# Altium schematic sheet p2_standby.SchDoc
size A2; Organization: Protel International P/L; Address1: L3, 12a Rodborough Rd; Address2: Frenchs Forest; Address3: NSW; Address4: Australia 2086
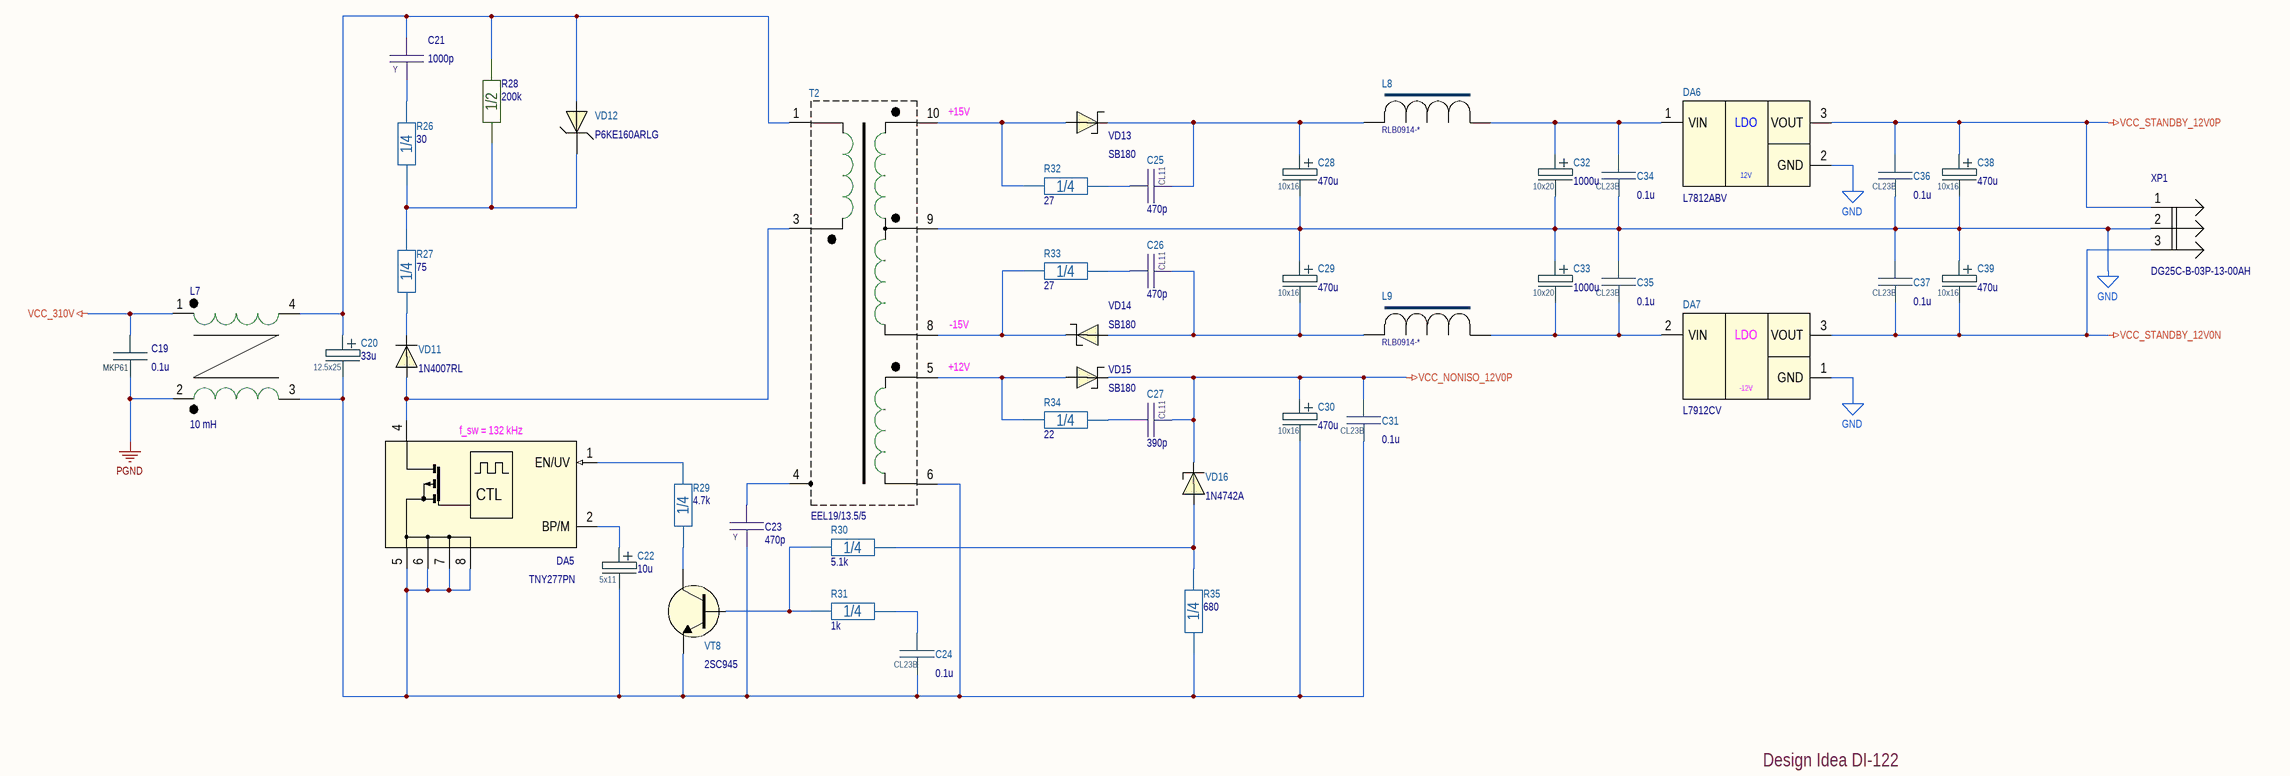
[diagram p0: p2_standby.SchDoc]

## Parts
C19  0.1u  [MKP61_13x12x6_P10]
C20  33u  Package: 12.5x25  [ECAP13X21X5_BRW]
C21  1000p  Package: Y  [JYC_Y2_CAP_7.5]
C22  10u  Package: 5x11  [ECAP5X11X2.0_BRW]
C23  470p  Package: Y  [JYC_Y2_CAP_6.5]
C24  0.1u  [CL23B_7.2x2.5]
C25  470p  [CL11_6x4_P4.0]
C26  470p  [CL11_6x4_P4.0]
C27  390p  [CL11_6x4_P4.0]
C28  470u  Package: 10x16  [ECAP10X17X5_BRW]
C29  470u  Package: 10x16  [ECAP10X17X5_BRW]
C30  470u  Package: 10x16  [ECAP10X17X5_BRW]
C31  0.1u  [CL23B_7.2x2.5]
C32  1000u  Package: 10x20  [ECAP10X21X5_BRW]
C33  1000u  Package: 10x20  [ECAP10X21X5_BRW]
C34  0.1u  [CL23B_7.2x2.5]
C35  0.1u  [CL23B_7.2x2.5]
C36  0.1u  [CL23B_7.2x2.5]
C37  0.1u  [CL23B_7.2x2.5]
C38  470u  Package: 10x16  [ECAP10X17X5_BRW]
C39  470u  Package: 10x16  [ECAP10X17X5_BRW]
DA5  TNY277PN  [DIP-8C]
DA6  L7812ABV  [TO-220AB-3]
DA7  L7912CV  [TO-220AB-3]
L7  10 mH  [UU9.8]
L8  RLB0914-*  [RLB0914]
L9  RLB0914-*  [RLB0914]
R26  30  Package: 1/4  [CFR-25]
R27  75  Package: 1/4  [CFR-25]
R28  200k  Package: 1/2  [CFR-50]
R29  4.7k  Package: 1/4  [CFR-25]
R30  5.1k  Package: 1/4  [CFR-25]
R31  1k  Package: 1/4  [CFR-25]
R32  27  Package: 1/4  [CFR-25]
R33  27  Package: 1/4  [CFR-25]
R34  22  Package: 1/4  [CFR-25]
R35  680  Package: 1/4  [CFR-25]
T2  EEL19/13.5/5  [EEL19/13.5/5]
VD11  1N4007RL  [DO-41]
VD12  P6KE160ARLG  [DO-15]
VD13  SB180  [DO-41]
VD14  SB180  [DO-41]
VD15  SB180  [DO-41]
VD16  1N4742A  [DO-41 GLASS DARK RED]
VT8  2SC945  [TO-92 (VERTICAL,LINE)]
XP1  DG25C-B-03P-13-00AH  [DG25C-B-03P-13-00AH]

## Nets
GND: C28.2 C29.1 C32.2 C33.1 C34.2 C35.1 C36.2 C37.1 C38.2 C39.1 DA6.2(GND) DA7.1(GND) T2.9 XP1.2
PGND: C19.1 L7.2
VCC_310V: C19.2 L7.1
VCC_NONISO_12V0P: C27.1 C30.1 C31.1 VD15.1(C) VD16.1(CATHODE)
VCC_STANDBY_12V0N: C37.2 C39.2 DA7.3(VOUT) XP1.3
VCC_STANDBY_12V0P: C36.1 C38.1 DA6.3(VOUT) XP1.1
NetC20_1: C20.1 C21.2 L7.4 R28.2 T2.1 VD12.2(A)
NetC20_2: C20.2 C22.2 C23.2 C24.2 C30.2 C31.2 DA5.5(SOURCE) DA5.6(SOURCE) DA5.7(SOURCE) DA5.8(SOURCE) L7.3 R35.2 T2.6 VT8.3(E)
NetC21_1: C21.1 R26.1
NetC22_1: C22.1 DA5.2(BP/M)
NetC23_1: C23.1 T2.4
NetC24_1: C24.1 R31.2
NetC25_1: C25.1 C28.1 L8.1 VD13.1(C)
NetC25_2: C25.2 R32.1
NetC26_1: C26.1 C29.2 L9.1 VD14.2(A)
NetC26_2: C26.2 R33.1
NetC27_2: C27.2 R34.1
NetC32_1: C32.1 C34.1 DA6.1(VIN) L8.2
NetC33_2: C33.2 C35.2 DA7.2(VIN) L9.2
NetDA5_1: DA5.1(EN/UV) R29.1
NetDA5_4: DA5.4(DRAIN) T2.3 VD11.2(A)
NetR26_2: R26.2 R27.1 R28.1 VD12.1(C)
NetR27_2: R27.2 VD11.1(C)
NetR29_2: R29.2 VT8.2(C)
NetR30_1: R30.1 R35.1 VD16.2(ANODE)
NetR30_2: R30.2 R31.1 VT8.1(B)
NetR32_2: R32.2 T2.10 VD13.2(A)
NetR33_2: R33.2 T2.8 VD14.1(C)
NetR34_2: R34.2 T2.5 VD15.2(A)

## Notes on the sheet
- (near T2) +15V
- (near T2) -15V
- (near T2) +12V
- (near DA5) f_sw = 132 kHz
- Design Idea DI-122 <https://www.power.com/sites/default/files/documents/di122.pdf>
- Title
- Size:
- Date:
- File:
- A2
- Number:
- Time:
- Revision:
- Sheet
- of
- (in symbol L7812ABV) LDO; 12V
- (in symbol L7912CV) LDO; -12V
- (in symbol TNY277PN) CTL

## Library data of the parts
C19 = MKP61: Metallized Polypropylene Film Capacitor for high voltage application; Tolerance: ± 10 %; Voltage: 300V; Value: 0.1u; Dielectric: Polypropylene; Value on schem: 0.1u; Part Number: *; Manufacturer: *; Package: MKP61
C20 = C_ECAP: Aluminium capacitor; Part Number: UCY2G330MHD; Manufacturer: Nichicon; Tolerance: ± 20 %; Voltage: 400V; Value: 33u; Value on schem: 33u
C21 = JB_Y2: High Voltage Ceramic Capacitor; Part Number: JYC3D102MBE; Manufacturer: JB; Tolerance: ± 20 %; Dielectric: Y5U; Voltage: 2000V; Value: 1000p; Value on schem: 1000p
C22 = C_ECAP: Aluminium capacitor; Part Number: UVR1J100MDD1TA; Manufacturer: Nichicon; Tolerance: ± 20 %; Voltage: 63V; Value: 10u; Value on schem: 10u
C23 = JB_Y2: High Voltage Ceramic Capacitor; Part Number: JYC3D471KBB; Manufacturer: JB; Tolerance: ± 10 %; Dielectric: Y5P; Voltage: 2000V; Value: 470p; Value on schem: 470p
C24 C31 C34-C37 = CL23B: Box-type metallized polyester film capacitor; Tolerance: ± * %; Voltage: 63V; Value: 0.1u; Dielectric: Polyester; Value on schem: 0.1u; Part Number: *; Manufacturer: *; Package: CL23B
C25 C26 = CL11: CL11 Type Polyester Film Metal Foil Capacitor-inductive; Part Number: CL11-2A471J; Manufacturer: Shengxin Capacitors; Tolerance: ± 5 %; Voltage: 100V; Value: 470p; Dielectric: Polyester; Value on schem: 470p; Package: CL11
C27 = CL11: CL11 Type Polyester Film Metal Foil Capacitor-inductive; Part Number: CL11-2A391J; Manufacturer: Shengxin Capacitors; Tolerance: ± 5 %; Voltage: 100V; Value: 390p; Dielectric: Polyester; Value on schem: 390p; Package: CL11
C28-C30 C38 C39 = C_ECAP: Aluminium capacitor; Part Number: UPW1E471MPD; Manufacturer: Nichicon; Tolerance: ± 20 %; Voltage: 25V; Value: 470u; Value on schem: 470u
C32 C33 = C_ECAP: Aluminium capacitor; Part Number: UVZ1E102MPD; Manufacturer: Nichicon; Tolerance: ± 20 %; Voltage: 25V; Value: 1000u; Value on schem: 1000u
DA5 = TNY277PN: Energy-Effi cient, Off-Line Switcher With Enhanced Flexibility and Extended Power Range; Manufacturer: Power Integrations; Package: DIP-8C; Part Number: TNY277PN
DA6 = L7812ABV: 12V, 1,5 A voltage regulator (Fixed version); Manufacturer: STMicroelectronics; Package: TO-220; Part Number: L7812ABV
DA7 = L7912CV: -12V, 1,5 A voltage regulator (Fixed version); Manufacturer: STMicroelectronics; Package: TO-220; Part Number: L7912CV
L7 = UU9.8: UU9.8 Ferrite Core inductor; Value: 10 mH; Core: UU9.8
L8 L9 = RLB0914: Radial Inductors; Manufacturer: Bourns Inc.; RDC: * Ohm; SRF Min: * MHz; Irms  Max: * A; Inductance @ 100 kHz: * µH; Part Number: RLB0914-*; Package: 8.7x12mm; Q: *; Isat  Typ: * A
R26 = CF25: Resistor 1/4W; Part Number: MFR-25FTF52-30R; Manufacturer: Yageo; Tolerance: ± 1 %; Voltage: 250V; Temperature Coefficient: ±100 ppm/°C; Value: 30; Value on schem: 30
R27 = CF25: Resistor 1/4W; Part Number: MFR-25FTF52-75R; Manufacturer: Yageo; Tolerance: ± 1 %; Voltage: 250V; Temperature Coefficient: ±100 ppm/°C; Value: 75; Value on schem: 75
R28 = CF50: Resistor 1/2W; Part Number: MFR-50JT-52-200K; Manufacturer: Yageo; Tolerance: ± 5 %; Temperature Coefficient: 350V; Value: 200k; Value on schem: 200k; Voltage: *
R29 = CF25: Resistor 1/4W; Part Number: MFR-25FTF52-4K7; Manufacturer: Yageo; Tolerance: ± 1 %; Voltage: 250V; Temperature Coefficient: ±100 ppm/°C; Value: 4.7k; Value on schem: 4.7k
R30 = CF25: Resistor 1/4W; Part Number: MFR-25FTF52-5K1; Manufacturer: Yageo; Tolerance: ± 1 %; Voltage: 250V; Temperature Coefficient: ±100 ppm/°C; Value: 5.1k; Value on schem: 5.1k
R31 = CF25: Resistor 1/4W; Part Number: MFR-25FTF52-1K; Manufacturer: Yageo; Tolerance: ± 1 %; Voltage: 250V; Temperature Coefficient: ±100 ppm/°C; Value: 1k; Value on schem: 1k
R32 R33 = CF25: Resistor 1/4W; Part Number: MFR-25FTF52-27R; Manufacturer: Yageo; Tolerance: ± 1 %; Voltage: 250V; Temperature Coefficient: ±100 ppm/°C; Value: 27; Value on schem: 27
R34 = CF25: Resistor 1/4W; Part Number: MFR-25FTF52-22R; Manufacturer: Yageo; Tolerance: ± 1 %; Voltage: 250V; Temperature Coefficient: ±100 ppm/°C; Value: 22; Value on schem: 22
R35 = CF25: Resistor 1/4W; Part Number: MFR-25FTF52-680R; Manufacturer: Yageo; Tolerance: ± 1 %; Voltage: 250V; Temperature Coefficient: ±100 ppm/°C; Value: 680; Value on schem: 680
T2 = EEL19_V1: EEL19 Ferrite Core, 2 output; Value: EEL19/13.5/5
VD11 = 1N4007RL: 1A 1000V Standard Recovery Rectifiers Diode; Manufacturer: ON Semiconductor; Part Number: 1N4007RL; Package: DO-41
VD12 = P6KE160ARLG: 600 Watt Peak Power Transient / Voltage Suppressors; Manufacturer: ON Semiconductor; Part Number: P6KE160ARLG; Package: DO-15
VD13-VD15 = SB180: 1A, 80V Schottky Barrier Rectifier; Manufacturer: ON Semiconductor; Part Number: SB180; Package: DO-41
VD16 = 1N4742A: 12V 1.0W ZENER DIODE; Manufacturer: Diodes Incorporated; Part Number: 1N4742A; Package: DO-41
VT8 = 2SC945: General Purpose n-p-n Transistors; Manufacturer: NEC; Package: TO-92; Part Number: 2SC945
XP1 = DG25C-B-03P-13-00AH: Manufacturer: Degson; Value: DG25C-B-03P-13-00AH